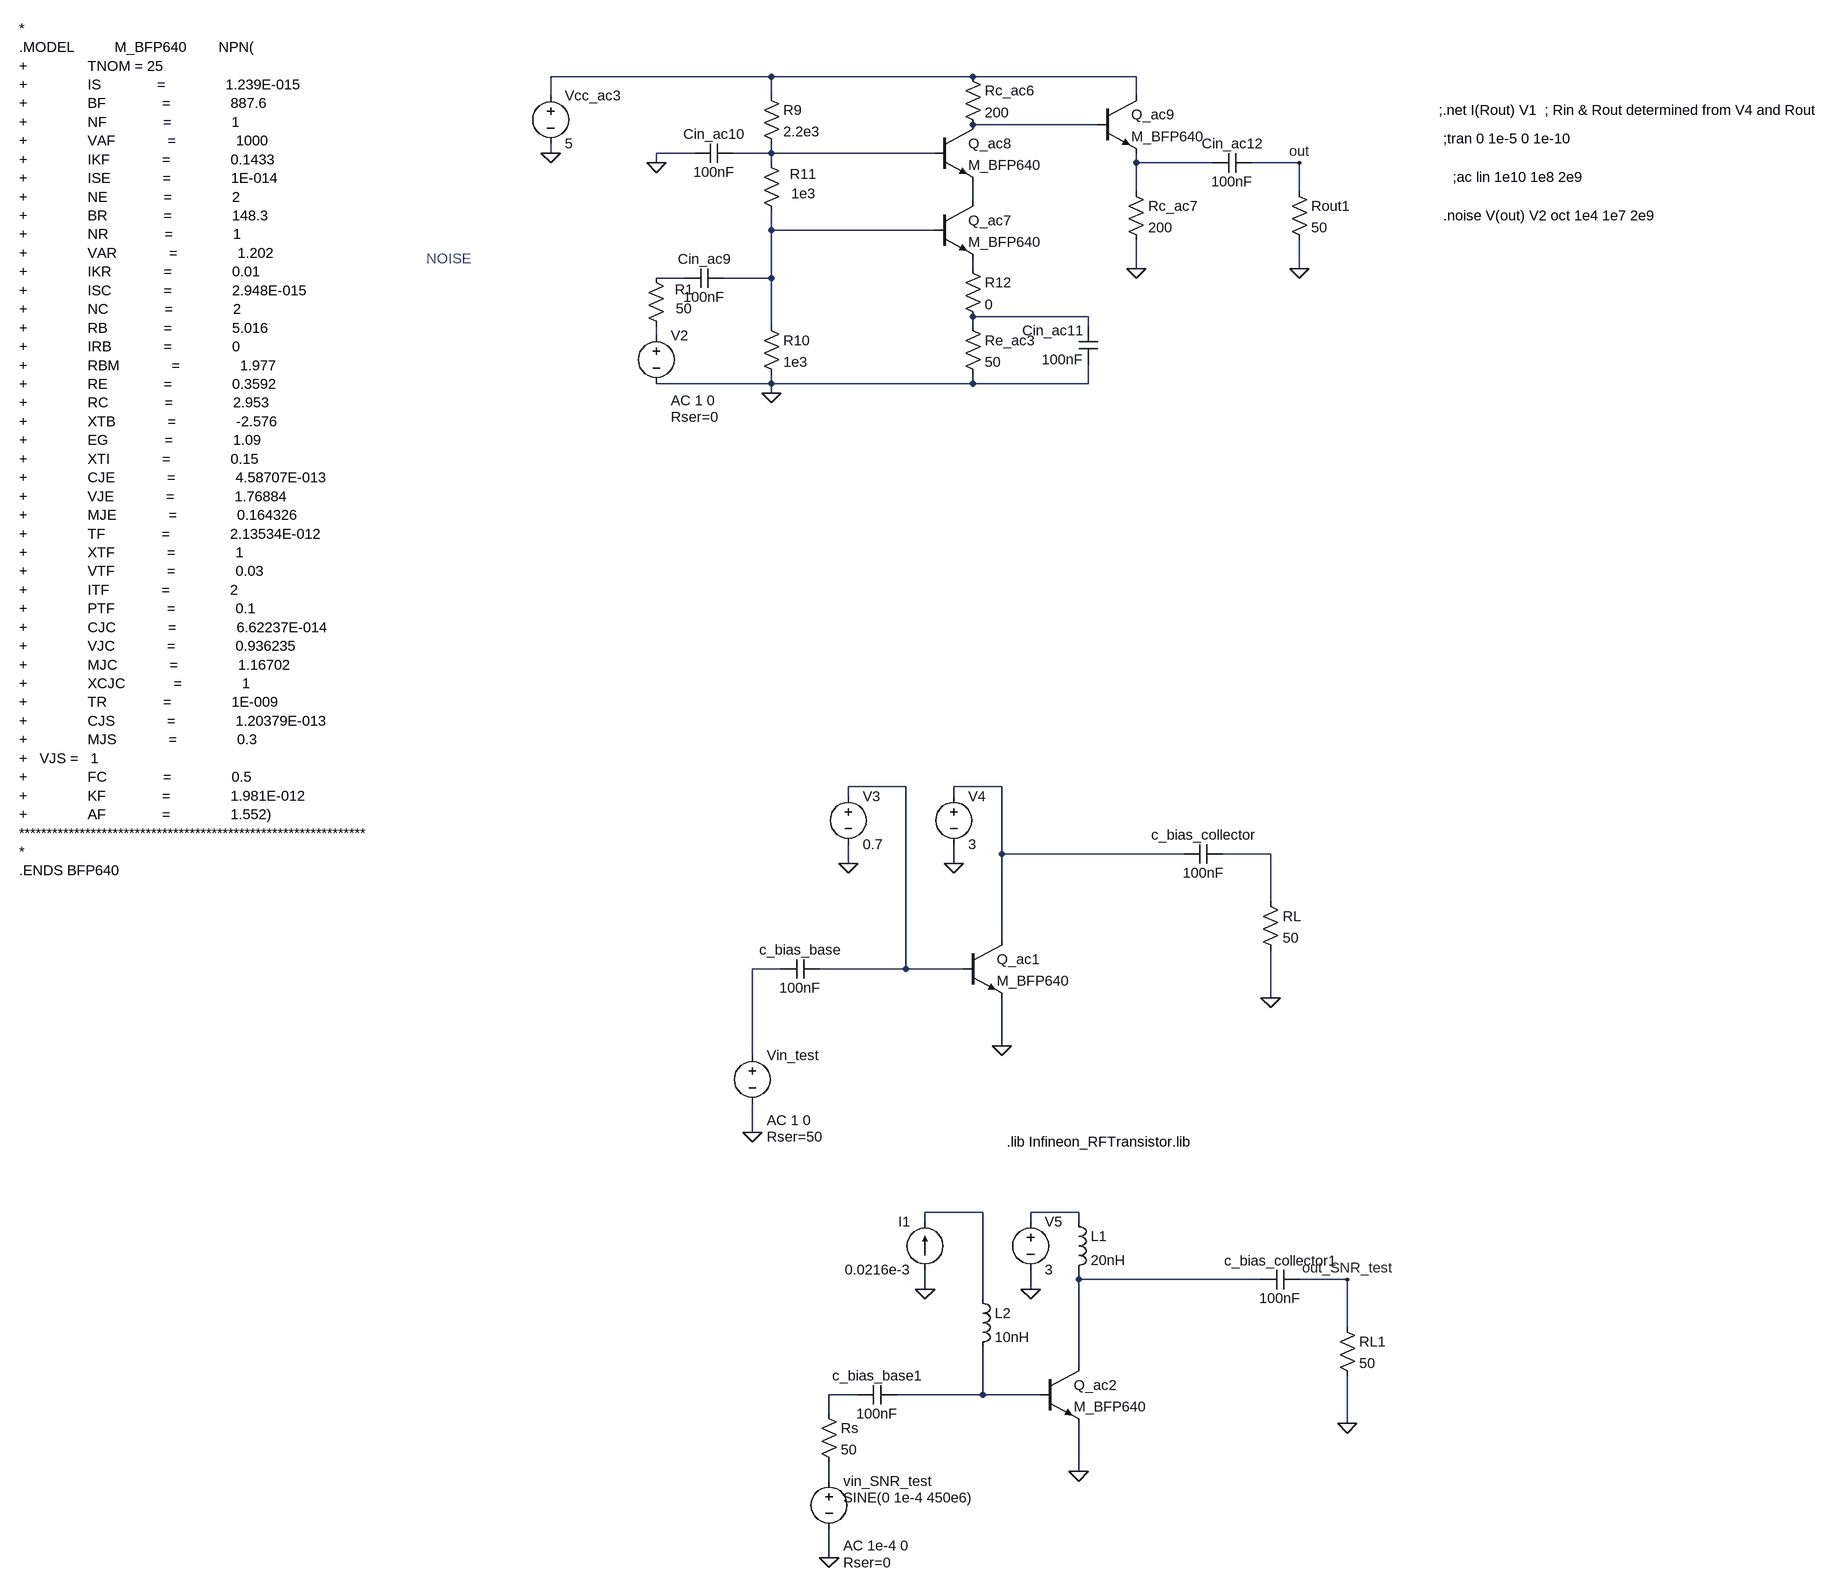
[diagram p0: schematic LNA_NOISE.asc]
LNA_NOISE.asc, the LTspice schematic file:
Version 4
SHEET 1 1984 4136
WIRE -80 1504 -448 1504
WIRE 256 1504 -80 1504
WIRE 528 1504 256 1504
WIRE -448 1536 -448 1504
WIRE -80 1536 -80 1504
WIRE 528 1536 528 1504
WIRE 464 1584 256 1584
WIRE -448 1632 -448 1616
WIRE -208 1632 -272 1632
WIRE -80 1632 -80 1616
WIRE -80 1632 -144 1632
WIRE 192 1632 -80 1632
WIRE -272 1648 -272 1632
WIRE -80 1648 -80 1632
WIRE 528 1648 528 1632
WIRE 656 1648 528 1648
WIRE 800 1648 720 1648
WIRE 528 1696 528 1648
WIRE 800 1696 800 1648
WIRE 256 1712 256 1680
WIRE -80 1760 -80 1728
WIRE 192 1760 -80 1760
WIRE 256 1824 256 1808
WIRE 528 1824 528 1776
WIRE 800 1824 800 1776
WIRE -224 1840 -272 1840
WIRE -80 1840 -80 1760
WIRE -80 1840 -160 1840
WIRE 448 1904 256 1904
WIRE -80 1920 -80 1840
WIRE 256 1920 256 1904
WIRE 448 1920 448 1904
WIRE -272 1936 -272 1920
WIRE -80 2016 -80 2000
WIRE -80 2016 -272 2016
WIRE 256 2016 256 2000
WIRE 256 2016 -80 2016
WIRE 448 2016 448 1984
WIRE 448 2016 256 2016
WIRE -80 2032 -80 2016
WIRE 144 2688 48 2688
WIRE 304 2688 224 2688
WIRE 48 2704 48 2688
WIRE 224 2704 224 2688
WIRE 304 2800 304 2688
WIRE 608 2800 304 2800
WIRE 752 2800 672 2800
WIRE 48 2816 48 2784
WIRE 224 2816 224 2784
WIRE 752 2880 752 2800
WIRE 304 2944 304 2800
WIRE -64 2992 -112 2992
WIRE 144 2992 144 2688
WIRE 144 2992 0 2992
WIRE 240 2992 144 2992
WIRE 752 3040 752 2960
WIRE 304 3120 304 3040
WIRE -112 3136 -112 2992
WIRE -112 3264 -112 3216
WIRE 272 3536 176 3536
WIRE 432 3536 352 3536
WIRE 176 3552 176 3536
WIRE 352 3552 352 3536
WIRE 432 3552 432 3536
WIRE 432 3648 432 3632
WIRE 736 3648 432 3648
WIRE 880 3648 800 3648
WIRE 176 3664 176 3632
WIRE 352 3664 352 3632
WIRE 272 3680 272 3536
WIRE 880 3728 880 3648
WIRE 432 3792 432 3648
WIRE 64 3840 16 3840
WIRE 272 3840 272 3760
WIRE 272 3840 128 3840
WIRE 368 3840 272 3840
WIRE 16 3872 16 3840
WIRE 880 3888 880 3808
WIRE 432 3968 432 3888
WIRE 16 3984 16 3952
WIRE 16 4112 16 4064
FLAG -448 1632 0
FLAG -80 2032 0
FLAG -272 1648 0
FLAG 528 1824 0
FLAG 800 1824 0
FLAG 800 1648 out
FLAG 304 3120 0
FLAG 752 3040 0
FLAG -112 3264 0
FLAG 48 2816 0
FLAG 224 2816 0
FLAG 432 3968 0
FLAG 880 3888 0
FLAG 16 4112 0
FLAG 176 3664 0
FLAG 352 3664 0
FLAG 880 3648 out_SNR_test
SYMBOL voltage -448 1520 R0
WINDOW 123 0 0 Left 0
WINDOW 39 0 0 Left 0
SYMATTR InstName Vcc_ac3
SYMATTR Value 5
SYMBOL npn 192 1712 R0
SYMATTR InstName Q_ac7
SYMATTR Value M_BFP640
SYMBOL res -96 1520 R0
SYMATTR InstName R9
SYMATTR Value 2.2e3
SYMBOL res -96 1904 R0
SYMATTR InstName R10
SYMATTR Value 1e3
SYMBOL res 240 1904 R0
SYMATTR InstName Re_ac3
SYMATTR Value 50
SYMBOL res 240 1488 R0
SYMATTR InstName Rc_ac6
SYMATTR Value 200
SYMBOL cap -160 1824 R90
WINDOW 0 0 32 VBottom 2
WINDOW 3 32 32 VTop 2
SYMATTR InstName Cin_ac9
SYMATTR Value 100nF
SYMBOL res -96 1632 R0
WINDOW 0 47 35 Left 2
WINDOW 3 49 67 Left 2
SYMATTR InstName R11
SYMATTR Value 1e3
SYMBOL npn 192 1584 R0
SYMATTR InstName Q_ac8
SYMATTR Value M_BFP640
SYMBOL cap -144 1616 R90
WINDOW 0 0 32 VBottom 2
WINDOW 3 32 32 VTop 2
SYMATTR InstName Cin_ac10
SYMATTR Value 100nF
SYMBOL cap 464 1984 R180
WINDOW 0 24 56 Left 2
WINDOW 3 24 8 Left 2
SYMATTR InstName Cin_ac11
SYMATTR Value 100nF
SYMBOL npn 464 1536 R0
SYMATTR InstName Q_ac9
SYMATTR Value M_BFP640
SYMBOL res 512 1680 R0
SYMATTR InstName Rc_ac7
SYMATTR Value 200
SYMBOL cap 720 1632 R90
WINDOW 0 0 32 VBottom 2
WINDOW 3 32 32 VTop 2
SYMATTR InstName Cin_ac12
SYMATTR Value 100nF
SYMBOL res 784 1680 R0
SYMATTR InstName Rout1
SYMATTR Value 50
SYMBOL res 240 1808 R0
SYMATTR InstName R12
SYMATTR Value 0
SYMBOL voltage -272 1920 R0
WINDOW 123 24 124 Left 2
WINDOW 39 24 152 Left 2
SYMATTR Value2 AC 1 0
SYMATTR SpiceLine Rser=0
SYMATTR InstName V2
SYMATTR Value ""
SYMBOL npn 240 2944 R0
SYMATTR InstName Q_ac1
SYMATTR Value M_BFP640
SYMBOL cap 0 2976 R90
WINDOW 0 0 32 VBottom 2
WINDOW 3 32 32 VTop 2
SYMATTR InstName c_bias_base
SYMATTR Value 100nF
SYMBOL voltage -112 3120 R0
WINDOW 123 24 124 Left 2
WINDOW 39 24 152 Left 2
SYMATTR Value2 AC 1 0
SYMATTR SpiceLine Rser=50
SYMATTR InstName Vin_test
SYMATTR Value ""
SYMBOL cap 672 2784 R90
WINDOW 0 0 32 VBottom 2
WINDOW 3 32 32 VTop 2
SYMATTR InstName c_bias_collector
SYMATTR Value 100nF
SYMBOL res 736 2864 R0
SYMATTR InstName RL
SYMATTR Value 50
SYMBOL voltage 48 2688 R0
WINDOW 123 0 0 Left 0
WINDOW 39 0 0 Left 0
SYMATTR InstName V3
SYMATTR Value 0.7
SYMBOL voltage 224 2688 R0
WINDOW 123 0 0 Left 0
WINDOW 39 0 0 Left 0
SYMATTR InstName V4
SYMATTR Value 3
SYMBOL npn 368 3792 R0
SYMATTR InstName Q_ac2
SYMATTR Value M_BFP640
SYMBOL cap 128 3824 R90
WINDOW 0 0 32 VBottom 2
WINDOW 3 32 32 VTop 2
SYMATTR InstName c_bias_base1
SYMATTR Value 100nF
SYMBOL voltage 16 3968 R0
WINDOW 123 24 124 Left 2
WINDOW 39 24 152 Left 2
WINDOW 3 24 44 Left 2
SYMATTR Value2 AC 1e-4 0
SYMATTR SpiceLine Rser=0
SYMATTR Value SINE(0 1e-4 450e6)
SYMATTR InstName vin_SNR_test
SYMBOL cap 800 3632 R90
WINDOW 0 0 32 VBottom 2
WINDOW 3 32 32 VTop 2
SYMATTR InstName c_bias_collector1
SYMATTR Value 100nF
SYMBOL res 864 3712 R0
SYMATTR InstName RL1
SYMATTR Value 50
SYMBOL voltage 352 3536 R0
WINDOW 123 0 0 Left 0
WINDOW 39 0 0 Left 0
SYMATTR InstName V5
SYMATTR Value 3
SYMBOL current 176 3632 R180
WINDOW 0 24 80 Left 2
WINDOW 3 24 0 Left 2
WINDOW 123 0 0 Left 0
WINDOW 39 0 0 Left 0
SYMATTR InstName I1
SYMATTR Value 0.0216e-3
SYMBOL ind 416 3536 R0
SYMATTR InstName L1
SYMATTR Value 20nH
SYMBOL ind 256 3664 R0
SYMATTR InstName L2
SYMATTR Value 10nH
SYMBOL res -288 1824 R0
WINDOW 0 47 35 Left 2
WINDOW 3 49 67 Left 2
SYMATTR InstName R1
SYMATTR Value 50
SYMBOL res 0 3856 R0
SYMATTR InstName Rs
SYMATTR Value 50
TEXT 1056 1672 Left 2 !;ac lin 1e10 1e8 2e9
TEXT 1032 1560 Left 2 !;.net I(Rout) V1  ; Rin & Rout determined from V4 and Rout
TEXT -800 1808 Left 2 ;NOISE
TEXT 1040 1736 Left 2 !.noise V(out) V2 oct 1e4 1e7 2e9
TEXT 1040 1608 Left 2 !;tran 0 1e-5 0 1e-10
TEXT 312 3280 Left 2 !.lib Infineon_RFTransistor.lib
TEXT -3736 1424 Left 2 !*\n.MODEL          M_BFP640        NPN(\n+               TNOM = 25\n+               IS              =               1.239E-015\n+               BF              =               887.6\n+               NF              =               1\n+               VAF             =               1000\n+               IKF             =               0.1433\n+               ISE             =               1E-014\n+               NE              =               2\n+               BR              =               148.3\n+               NR              =               1\n+               VAR             =               1.202\n+               IKR             =               0.01\n+               ISC             =               2.948E-015\n+               NC              =               2\n+               RB              =               5.016\n+               IRB             =               0\n+               RBM             =               1.977\n+               RE              =               0.3592\n+               RC              =               2.953\n+               XTB             =               -2.576\n+               EG              =               1.09\n+               XTI             =               0.15\n+               CJE             =               4.58707E-013\n+               VJE             =               1.76884\n+               MJE             =               0.164326\n+               TF              =               2.13534E-012\n+               XTF             =               1\n+               VTF             =               0.03\n+               ITF             =               2\n+               PTF             =               0.1\n+               CJC             =               6.62237E-014\n+               VJC             =               0.936235\n+               MJC             =               1.16702\n+               XCJC            =               1\n+               TR              =               1E-009\n+               CJS             =               1.20379E-013\n+               MJS             =               0.3\n+   VJS =   1\n+               FC              =               0.5\n+               KF              =               1.981E-012\n+               AF              =               1.552)\n***************************************************************\n*\n.ENDS BFP640

The netlist it stands for:
* LNA_NOISE.asc
Vcc_ac3 N001 0 5
Q_ac7 N005 N006 N007 0 M_BFP640
R9 N001 N003 2.2e3
R10 N006 0 1e3
Re_ac3 N009 0 50
Rc_ac6 N001 N002 200
Cin_ac9 N006 N008 100nF
R11 N003 N006 1e3
Q_ac8 N002 N003 N005 0 M_BFP640
Cin_ac10 N003 0 100nF
Cin_ac11 0 N009 100nF
Q_ac9 N001 N002 N004 0 M_BFP640
Rc_ac7 N004 0 200
Cin_ac12 out N004 100nF
Rout1 out 0 50
R12 N007 N009 0
V2 N010 0 AC 1 0 Rser=0
Q_ac1 N012 N011 0 0 M_BFP640
c_bias_base N011 N014 100nF
Vin_test N014 0 AC 1 0 Rser=50
c_bias_collector N013 N012 100nF
RL N013 0 50
V3 N011 0 0.7
V4 N012 0 3
Q_ac2 N017 N019 0 0 M_BFP640
c_bias_base1 N019 N018 100nF
vin_SNR_test N020 0 SINE(0 1e-4 450e6) AC 1e-4 0 Rser=0
c_bias_collector1 out_SNR_test N017 100nF
RL1 out_SNR_test 0 50
V5 N016 0 3
I1 0 N015 0.0216e-3
L1 N016 N017 20nH
L2 N015 N019 10nH
R1 N008 N010 50
Rs N018 N020 50
.model NPN NPN
.model PNP PNP
.lib standard.bjt
;ac lin 1e10 1e8 2e9
;.net I(Rout) V1  ; Rin & Rout determined from V4 and Rout
* NOISE
.noise V(out) V2 oct 1e4 1e7 2e9
;tran 0 1e-5 0 1e-10
.lib Infineon_RFTransistor.lib
*
.MODEL          M_BFP640        NPN(
+               TNOM = 25
+               IS              =               1.239E-015
+               BF              =               887.6
+               NF              =               1
+               VAF             =               1000
+               IKF             =               0.1433
+               ISE             =               1E-014
+               NE              =               2
+               BR              =               148.3
+               NR              =               1
+               VAR             =               1.202
+               IKR             =               0.01
+               ISC             =               2.948E-015
+               NC              =               2
+               RB              =               5.016
+               IRB             =               0
+               RBM             =               1.977
+               RE              =               0.3592
+               RC              =               2.953
+               XTB             =               -2.576
+               EG              =               1.09
+               XTI             =               0.15
+               CJE             =               4.58707E-013
+               VJE             =               1.76884
+               MJE             =               0.164326
+               TF              =               2.13534E-012
+               XTF             =               1
+               VTF             =               0.03
+               ITF             =               2
+               PTF             =               0.1
+               CJC             =               6.62237E-014
+               VJC             =               0.936235
+               MJC             =               1.16702
+               XCJC            =               1
+               TR              =               1E-009
+               CJS             =               1.20379E-013
+               MJS             =               0.3
+   VJS =   1
+               FC              =               0.5
+               KF              =               1.981E-012
+               AF              =               1.552)
***************************************************************
*
.ENDS BFP640
.backanno
.end